# Altium schematic sheet USB_Clone.SchDoc: USB
size A4; Date: Not used; ApprovedBy: Not used; CheckedBy: Not used; Author: Not used; CompanyName: STMicroelectronics; DrawnBy: Not used; Engineer: Not used; Organization: Not used; Address1: Not used; Address2: Not used; Address3: Not used; Address4: Not used; DocumentNumber: 7; Revision: Not used; SheetNumber: 7; SheetTotal: 9; CurrentTime: Not used; CurrentDate: Not used; Time: Not used; DocumentFullPathAndName: Not used; DocumentName: Not used; ModifiedDate: Not used; ImagePath: Not used; ProjectName: Not used; Application_BuildNumber: Not used
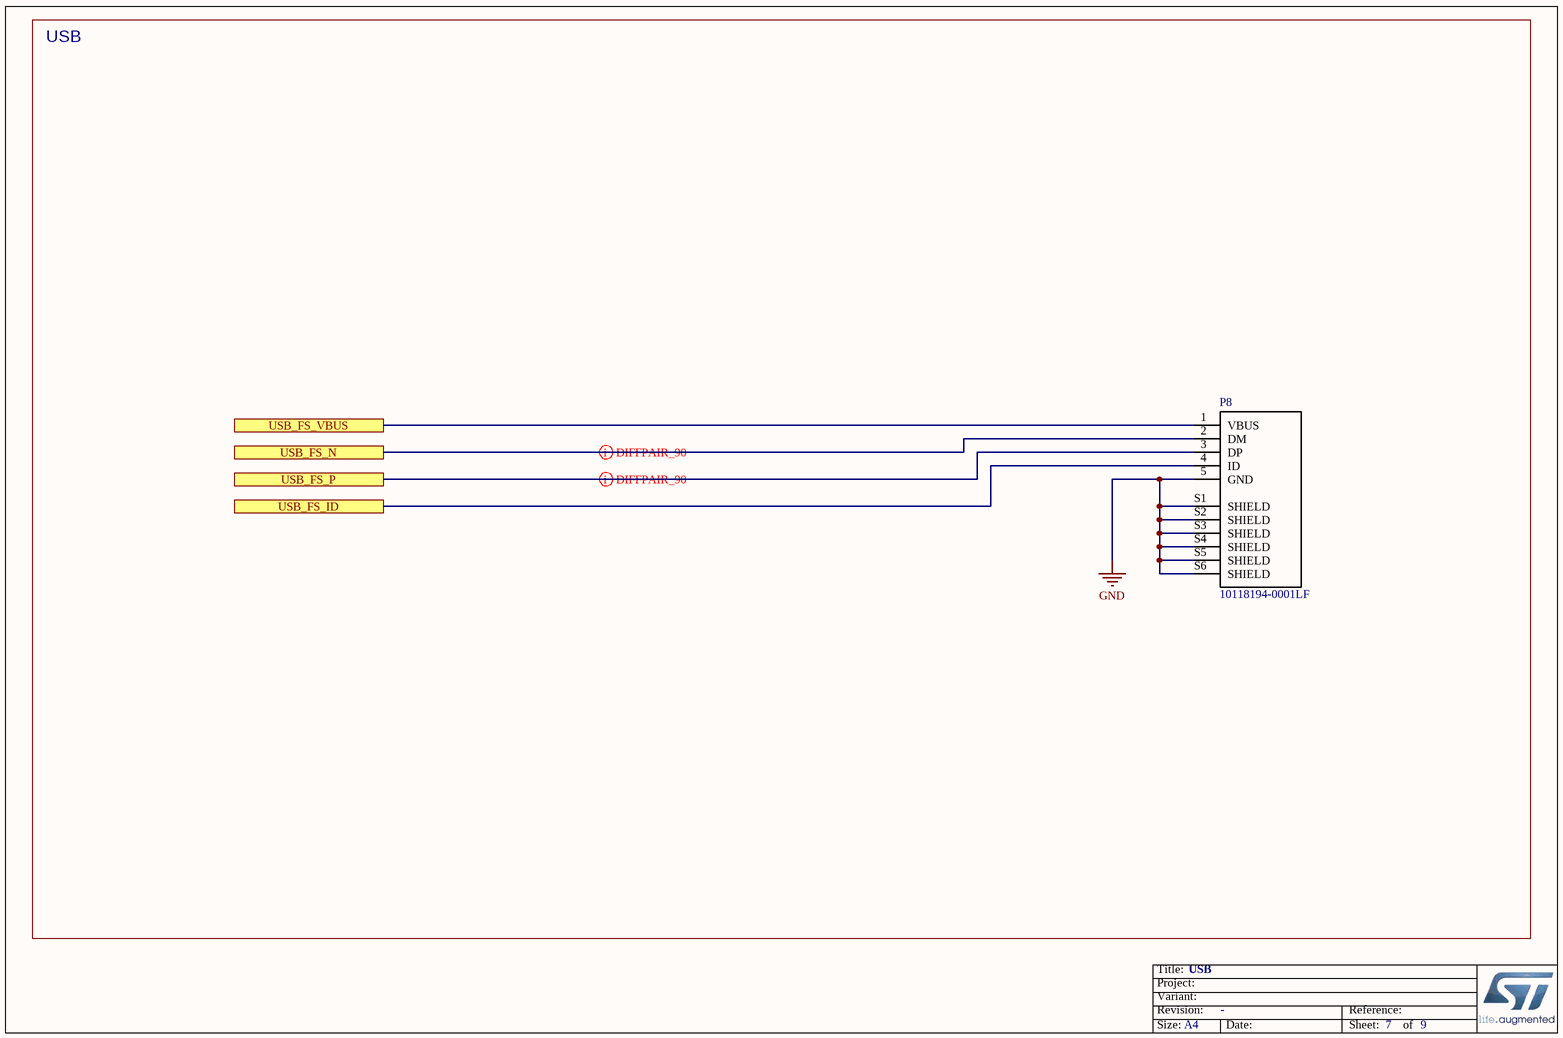
[diagram p0: USB_Clone.SchDoc]

## Parts
P8  10118194-0001LF  [USB Micro B Receptacle]

## Ports
USB_FS_ID, USB_FS_N, USB_FS_P, USB_FS_VBUS

## Nets
GND: P8.5(GND) P8.S1(SHIELD) P8.S2(SHIELD) P8.S3(SHIELD) P8.S4(SHIELD) P8.S5(SHIELD) P8.S6(SHIELD)
USB_FS_ID: P8.4(ID) ; port USB_FS_ID
USB_FS_N: P8.2(DM) ; port USB_FS_N
USB_FS_P: P8.3(DP) ; port USB_FS_P
USB_FS_VBUS: P8.1(VBUS) ; port USB_FS_VBUS

## Layout directives
differential pair: USB_FS_N, USB_FS_P

## Notes on the sheet
- USB
- Title:
- Project:
- Size:
- Revision:
- Variant:
- A4
- -
- Date:
- Reference:
- Sheet:
- of

## Library data of the parts
P8 = USB Micro B Receptacle: USB - micro B USB 2.0 Receptacle Connector 5 Position Surface Mount, Right Angle; Through Hole; MF: Amphenol ICC (FCI); Rating: 100VAC 1.8A; Digikey: 609-4618-1-ND; Digikey Link: https://www.digikey.ca/product-detail/en/amphenol-icc-fci/10118194-0001LF/609-4618-1-ND/2785382; MP: 10118194-0001LF; Price: 0.62000 CAD; ComponentLink1Description: Digikey; ComponentLink1URL: https://www.digikey.ca/product-detail/en/amphenol-icc-fci/10118194-0001LF/609-4618-1-ND/2785382; ComponentLink2Description: Datasheet; ComponentLink2URL: https://www.digikey.ca/en/datasheets/amphenol-fci/amphenol-fci-io-usb-micro